# Altium schematic sheet TXD-RXD.SchDoc
size A
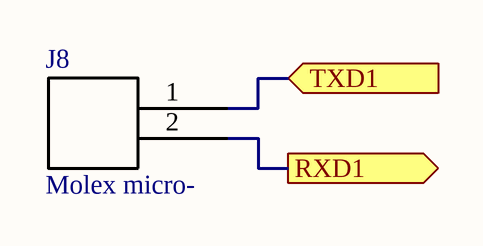
[diagram p0: TXD-RXD.SchDoc]

## Parts
J8  Molex micro-  [0430450227]

## Ports
RXD1 (out), TXD1 (in)

## Nets
RXD1: J8.2 ; port RXD1
TXD1: J8.1 ; port TXD1

## Library data of the parts
J8 = Molex micro-fit 2-pin: Molex micro-fit 3.0. Molex P/N 0430450227